# EAGLE design LB_BIT_i13_LIGHTSENSOR-v02(rev1) (EAGLE 6.6.0)
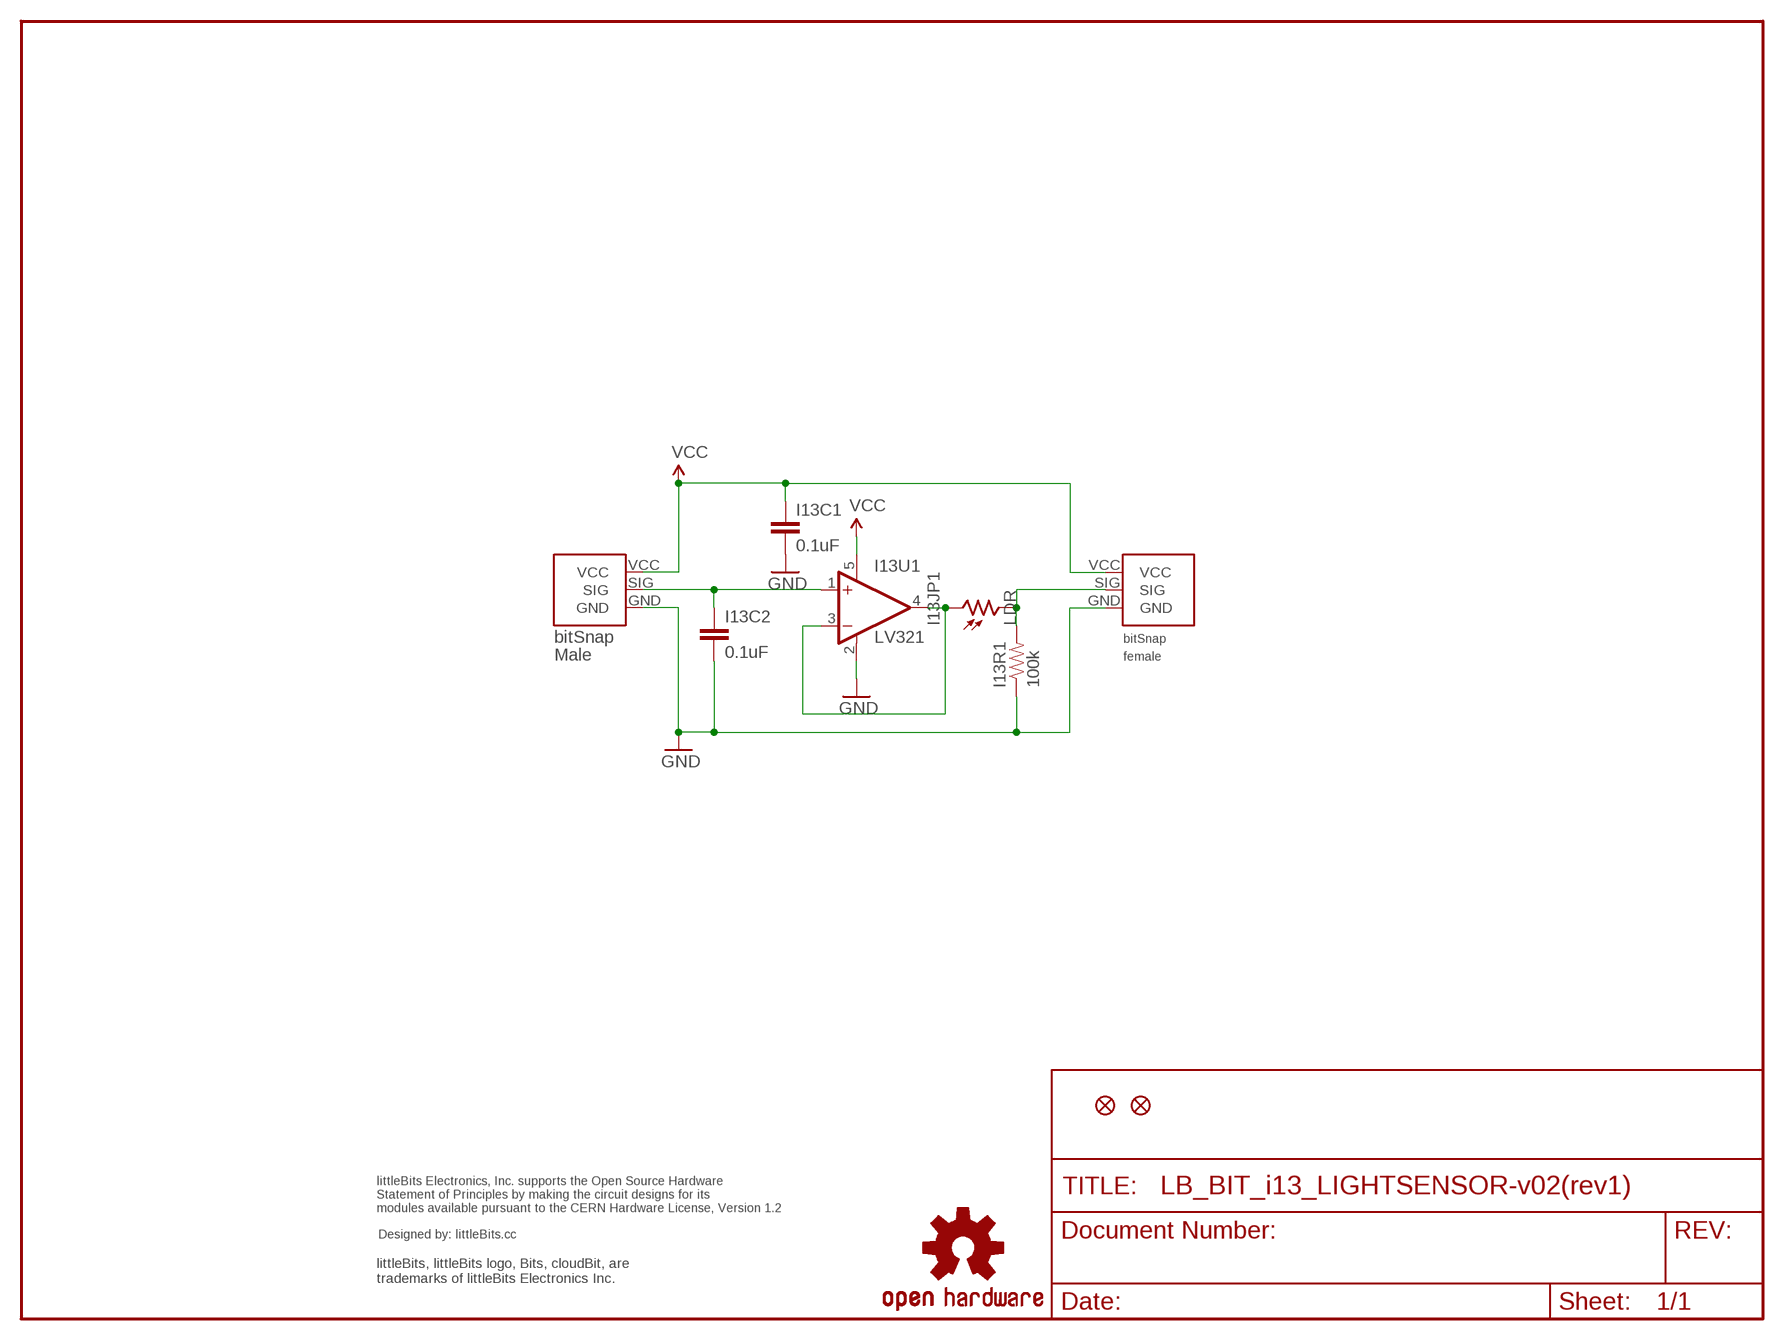
[diagram p0: schematic, sheet 1]

## Parts
I13BSF  BITSNAP_FEMALE  [BITSNAP_FEMALE]
I13BSM  BITSNAP_MALE  [BITSNAP_MALE]
I13C1  0.1uF  CAP0603-CAP  [0603-CAP]
I13C2  0.1uF  CAP0603-CAP  [0603-CAP]
I13FD1  FIDUCIAL1X2  [FIDUCIAL-1X2]
I13FD2  FIDUCIAL1X2  [FIDUCIAL-1X2]
I13JP1  LDR  A1050_09  [T0-46-A10XX]
I13R1  100k  RESISTOR0603-RES  [0603-RES]
I13U1  LV321  [SC70-5]
U$1  OSHWCREDIT  [OSHWCREDIT]
U$19  OSHW-LOGOL  [OSHW-LOGO-L]

## Nets
GND: I13BSF.GND I13BSM.GND I13C1.2 I13C2.2 I13R1.1 I13U1.2(V-)
N$6: I13JP1.1 I13U1.3(-IN) I13U1.4(OUT)
PS: I13BSF.SIG I13JP1.2 I13R1.2
SIG: I13BSM.SIG I13C2.1 I13U1.1(+IN)
VCC: I13BSF.VCC I13BSM.VCC I13C1.1 I13U1.5(V+)

## Library data of the parts
I13BSF = bitSnap:BITSNAP_FEMALE
I13BSM = bitSnap:BITSNAP_MALE
I13C1 I13C2 = SparkFun:CAP: Capacitor Standard 0603 ceramic capacitor, and 0.1" leaded capacitor.
I13FD1 I13FD2 = SparkFun:FIDUCIAL: Fiducial Alignment Points Various fiducial points for machine vision alignment.
I13JP1 = photo-elements:A10: Sensor Robust Light Sensing Applications Outdoor Light Sensing Application Source: http://optoelectronics.perkinelmer.com/content/Datasheets/DTS_PhotocellsA1050.pdf
I13R1 = SparkFun:RESISTOR: Resistor Basic schematic elements and footprints for 0603, 1206, and PTH 1/10th watt (small) resistors.
I13U1 = LITTLEBITS:LV321
U$1 = LITTLEBITS:OSHWCREDIT
U$19 = SparkFun_NEW:OSHW-LOGO: Open Source Hardware Logo This logo indicates the piece of hardware it is found on incorporates a OSHW license and/or adheres to the definition of open source hardware found here: http://freedomdefined.org/OSHW

## Board
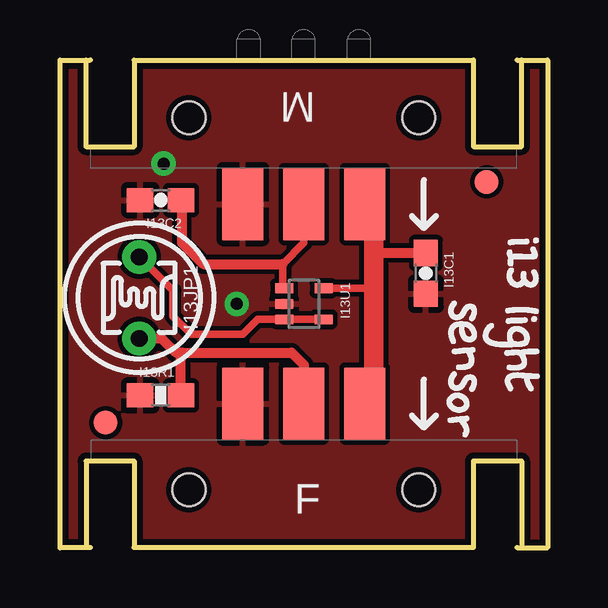
[diagram p1: board, top side]
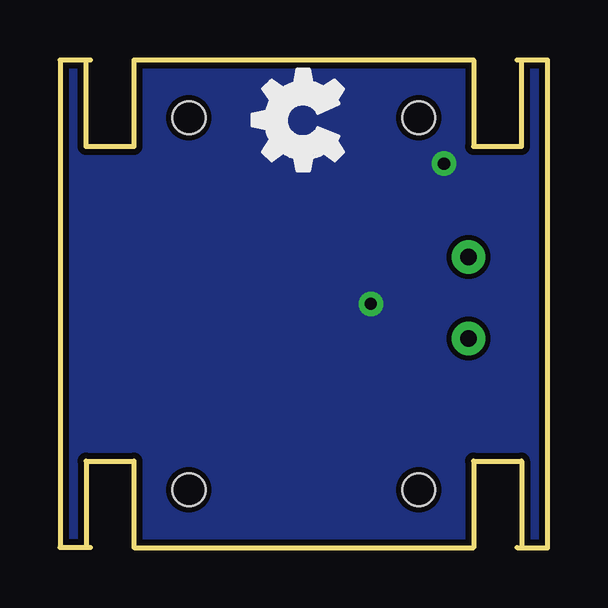
[diagram p2: board, bottom side, seen from below]

Size 20.32 x 20.33 mm. Coordinates in mm from the lower left corner, seen from the top.
Outline: 0,0 0,0.01
Outline: 0,0.01 0,20.33 1.27,20.33
Outline: 19.05,20.33 20.32,20.33 20.32,0.01 19.05,0.01
Outline: 1.27,0.01 0,0.01
Copper layers (1*16): Top 0.035mm / dielectric 1.5mm / Bottom 0.035mm
Design rules "default": minimum track width 8mil, minimum drill 20mil, track to track 8mil, track to pad 8mil, pad to pad 8mil, via to via 8mil, smd to smd 8mil, copper to edge 10mil, drill to drill 8mil, minimum pad ring 12mil, minimum via ring 10mil, stop-mask expansion 4mil, vias tented up to drill 25mil, thermal gap 10mil

### Footprints (pad centres in the part's own frame; a part is rotated, then mirrored left to right if it is on the bottom)
BITSNAP_FEMALE = smd 1.7 x 3: GND 6.35,6; SIG 8.89,6; VCC 11.43,6 | hole 1.37: 13.68,2.41; 4.1,2.41
BITSNAP_MALE = smd 1.7 x 3: GND 11.43,6; SIG 8.89,6; VCC 6.35,6 | hole 1.37: 13.68,2.41; 4.1,2.41
0603-CAP = smd 1.1 x 1: 1 -0.85,0; 2 0.85,0
FIDUCIAL-1X2 = smd 1 x 1: 1 0,0
T0-46-A10XX = drill 0.7 pad 1.4: 1 -1.7,0; 2 1.7,0
0603-RES = smd 1.1 x 1: 1 -0.85,0; 2 0.85,0
SC70-5 = smd 0.4 x 0.75: 1 -0.65,-0.825; 2 0,-0.825; 3 0.65,-0.825; 4 0.65,0.825; 5 -0.65,0.825

### Placement (x,y rotation side)
I13BSF  1.27,0.01 0 top
I13BSM  19.05,20.33 180 top
I13C1  15.24,11.44 270 top
I13C2  4.19,14.49 180 top
I13FD1  1.91,5.22 0 top
I13FD2  17.78,15.25 0 top
I13JP1  3.3,10.42 270 top
I13R1  4.19,6.36 0 top
I13U1  10.16,10.17 270 top
U$1  -16.51,-21.58 0 top  (outside the outline)
U$2  [I]  18.52,13.04 270 top
U$3  [1]  18.59,12.66 270 top
U$5  [3]  18.59,11.82 270 top
U$6  [OSHW_FILLX150_NOTEXT]  8.51,14.87 0 top
U$8  [L]  18.44,10.14 270 top
U$9  [I]  18.44,9.76 270 top
U$10  [G]  17.6,9.54 270 top
U$11  [H]  18.29,8.32 270 top
U$12  [T]  18.44,7.48 270 top
U$13  [S]  16.08,10.42 270 top
U$14  [E]  16,9.66 270 top
U$15  [N]  16.28,8.39 270 top
U$16  [S]  16.08,7.48 270 top
U$17  [O]  16.03,6.64 270 top
U$18  [R]  15.95,5.75 270 top
U$19  -12.7,-8.88 0 top  (outside the outline)

### Tracks (layer width: path | path; a pad name or v marks a point on that pad's centre or on a via)
GND  (via drill 0.51)
  other vias: 7.37,10.17 4.32,16.01
  pour Bottom: 0,20.33 0,0.01 20.32,0.01 20.32,20.33
  pour Top: 0,20.33 0,0.01 20.32,0.01 20.32,20.33
N$6
  Top 0.305: I13U1.4 I13U1.3 8.24,9.52 7.62,8.9 5.46,8.9 4.7,9.66 4.7,10.73 I13JP1.1
PS
  Top 0.406: I13JP1.2 4.24,8.72 4.83,8.14 5.08,8.14 | 5.08,8.14 9.65,8.14 10.16,7.63 I13BSF.SIG | I13R1.2 5.04,8.1 5.08,8.14
SIG
  Top 0.305: I13BSM.SIG 10.16,12.71 9.27,11.82 9.27,10.88 I13U1.1
  Top 0.406: 9.27,11.82 5.97,11.82 5.08,12.71 5.08,14.45 I13C2.1
VCC
  Top 0.305: I13U1.5 13.07,10.82 13.08,10.8
  Top 0.406: 13.12,12.29 I13C1.1
  Top 0.61: 13.02,11.12 13.08,11.06 13.12,12.29
  Top 0.813: I13BSF.VCC 12.7,6.61 13.08,7 13.08,10.8 13.08,11.06 13.08,13.95 I13BSM.VCC

### Text on the board
tValues: LDR